# Altium schematic sheet TDesktop.SchDoc: LiveDesign Evaluation - Alarm Clock
size A3; Organization: Altium Limited; Address1: L3, 12a Rodborough Rd; Address2: Frenchs Forest; Address3: NSW; Address4: Australia 2086; DocumentNumber: 8; SheetNumber: 8; SheetTotal: 10
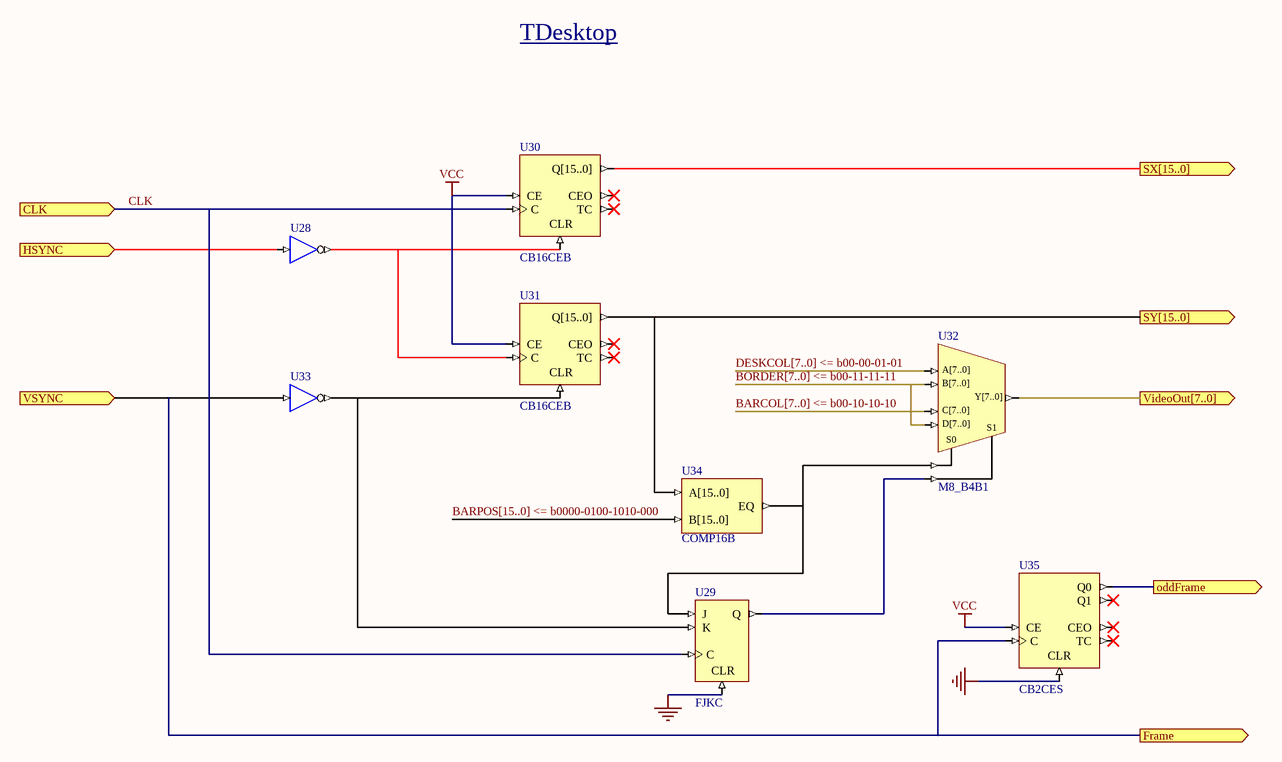
[diagram p0: TDesktop.SchDoc]

## Parts
U28  INV  (value not drawn)
U29  FJKC
U30  CB16CEB
U31  CB16CEB
U32  M8_B4B1
U33  BUF  (value not drawn)
U34  COMP16B
U35  CB2CES

## Ports
CLK (in), Frame (out), HSYNC (in), oddFrame (out), SX[15..0] (out), SY[15..0] (out), VideoOut[7..0] (out), VSYNC (in)

## Nets
GND: U29.CLR U35.CLR
VCC: U30.CE U31.CE U35.CE
BARCOL[7..0] <= b00-10-10-10: U32.C[7..0]
BARPOS[15..0] <= b0000-0100-1010-000: U34.B[15..0]
BORDER[7..0] <= b00-11-11-11: U32.B[7..0] U32.D[7..0]
CLK: U29.C U30.C ; port CLK
DESKCOL[7..0] <= b00-00-01-01: U32.A[7..0]
Frame: U33.I U35.C ; port VSYNC, port Frame
HSYNC: U28.I ; port HSYNC
oddFrame: U35.Q0 ; port oddFrame
SX[15..0]: U30.Q[15..0] ; port SX[15..0]
SY[15..0]: U31.Q[15..0] U34.A[15..0] ; port SY[15..0]
VideoOut[7..0]: U32.Y[7..0] ; port VideoOut[7..0]
NetU28_O: U28.O U30.CLR U31.C
NetU29_J: U29.J U32.S0 U34.EQ
NetU29_K: U29.K U31.CLR U33.O
NetU29_Q: U29.Q U32.S1

Not connected (* = marked no-connect by the designer): U30 CEO* TC*; U31 CEO* TC*; U35 CEO* Q1* TC*

## Buses and harness runs
bus BARCOL[7..0] <= b00-10-10-10
bus BARPOS[15..0] <= b0000-0100-1010-000
bus BORDER[7..0] <= b00-11-11-11
bus DESKCOL[7..0] <= b00-00-01-01

## Notes on the sheet
- TDesktop
- Title
- Size:
- Date:
- A3
- Number:
- Time:
- Revision:
- Sheet
- of
- File:

## Library data of the parts
U28 U33 = INV: Inverter; ArchiveName: GENERIC; VHDLIB_SIM: GENERIC_LIB; Published: 29-Jan-2004; Publisher: Altium Limited; Xilinx Equivalent: INV; Core Revision: 1.00.00
U29 = FJKC: J-K Flip-Flop with Asynchronous Clear; ArchiveName: GENERIC; VHDLIB_SIM: GENERIC_LIB; Published: 29-Jan-2004; Publisher: Altium Limited; Xilinx Equivalent: FJKC; Core Revision: 1.00.00
U30 U31 = CB16CEB: 16-Bit Cascadable Binary Counters with Clock Enable and Asynchronous Clear, Bus Version; Xilinx Equivalent: CB16CE; ArchiveName: GENERIC; VHDLIB_SIM: GENERIC_LIB; Published: 29-Jan-2004; Publisher: Altium Limited; Core Revision: 1.00.00
U32 = M8_B4B1: 4x8-Bit Bus to 1x8-Bit Bus Multiplexer; ArchiveName: GENERIC; VHDLIB_SIM: GENERIC_LIB; Published: 29-Jan-2004; Publisher: Altium Limited; Core Revision: 1.00.00
U34 = COMP16B: 16-Bit Identity Comparator, Bus Version; Xilinx Equivalent: COMP16; ArchiveName: GENERIC; VHDLIB_SIM: GENERIC_LIB; Published: 29-Jan-2004; Publisher: Altium Limited; Core Revision: 1.00.00
U35 = CB2CES: 2-Bit Cascadable Binary Counters with Clock Enable and Asynchronous Clear, Single Pin Version; Xilinx Equivalent: CB2CE; ArchiveName: GENERIC; VHDLIB_SIM: GENERIC_LIB; Published: 29-Jan-2004; Publisher: Altium Limited; Core Revision: 1.00.00